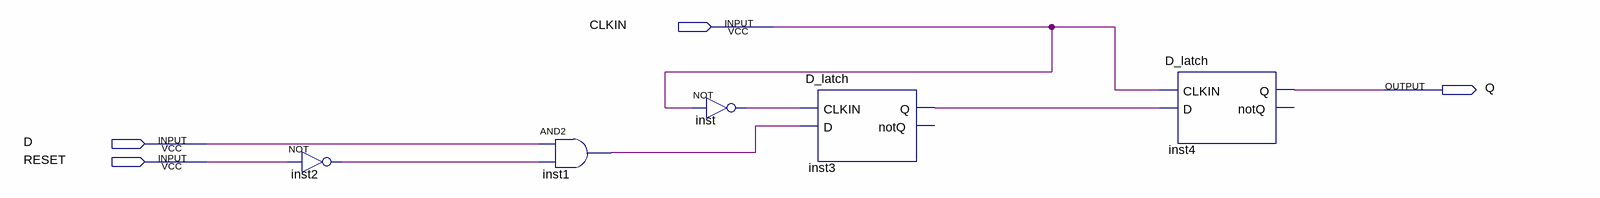
[diagram p0: schematic sheet]
// Quartus schematic ResettableDFlipFlop.bdf as structural Verilog: 5 symbols, 4 pins
module ResettableDFlipFlop (
  input  CLKIN,
  input  D,
  input  RESET,
  output Q
);

  wire inst1_out, inst2_out, inst3_q, inst_out;

  not inst2 (inst2_out, RESET);
  and inst1 (inst1_out, D, inst2_out);
  not inst (inst_out, CLKIN);
  D_latch inst3 (.CLKIN(inst_out), .D(inst1_out), .Q(inst3_q));  // open: notQ
  D_latch inst4 (.CLKIN(CLKIN), .D(inst3_q), .Q(Q));  // open: notQ
endmodule
